# Altium schematic sheet RS232_485.SchDoc
size A4
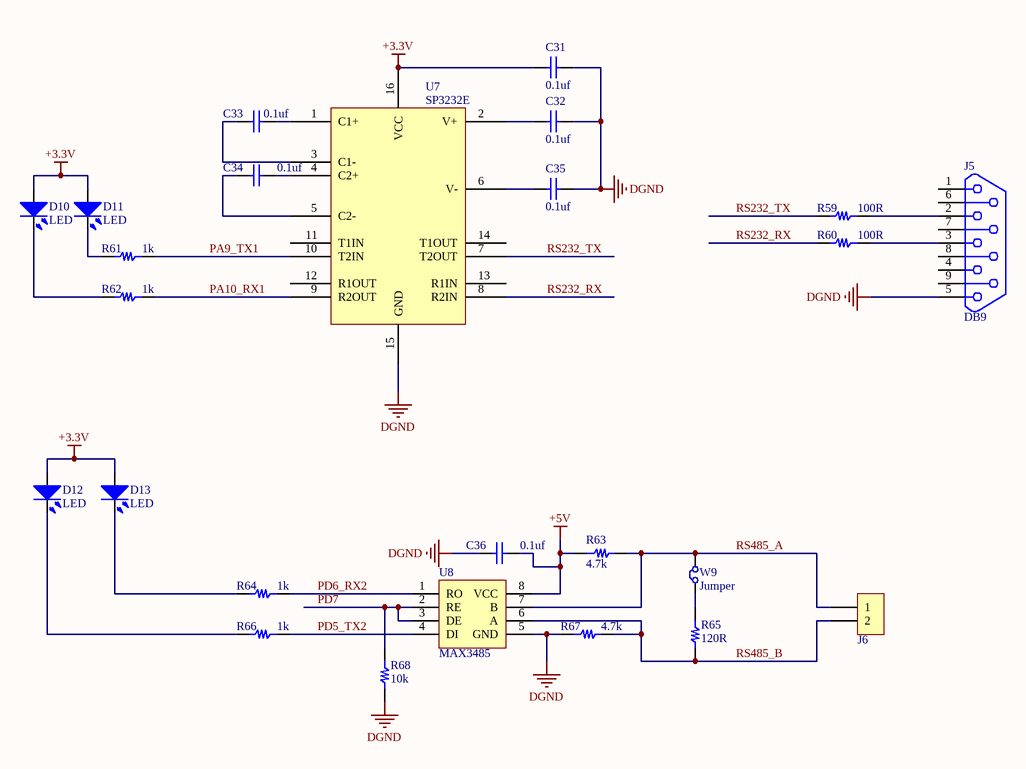
[diagram p0: RS232_485.SchDoc]

## Parts
C31  0.1uf  [0805C]
C32  0.1uf  [0805C]
C33  0.1uf  [0805C]
C34  0.1uf  [0805C]
C35  0.1uf  [0805C]
C36  0.1uf  [0805C]
D10  LED  [0805-LED-RED]
D11  LED  [0805-LED-RED]
D12  LED  [0805-LED-RED]
D13  LED  [0805-LED-RED]
J5  DB9  [DB9RA/M]
J6  CON2  [XH2.54-2P]  (value not drawn)
R59  100R  [0805_small]
R60  100R  [0805_small]
R61  1k  [0805_small]
R62  1k  [0805_small]
R63  4.7k  [0805_small]
R64  1k  [0805_small]
R65  120R  [0805_small]
R66  1k  [0805_small]
R67  4.7k  [0805_small]
R68  10k  [0805_small]
U7  SP3232E  [SO-16]
U8  MAX3485  [SO-8]
W9  Jumper  [0603_jump_Pad]

## Nets
+3.3V: C31.2 D10.1(A) D11.1(A) D12.1(A) D13.1(A) U7.16(VCC)
+5V: C36.1 R63.1 U8.8(VCC)
DGND: C31.1 C32.1 C35.1 C36.2 J5.5 R67.1 R68.2 U7.15(GND) U8.5(GND)
PA9_TX1: R61.1 U7.10(T2IN)
PA10_RX1: R62.1 U7.9(R2OUT)
PD5_TX2: R66.1 U8.4(DI)
PD6_RX2: R64.1 U8.1(RO)
PD7: R68.1 U8.2(RE) U8.3(DE)
RS232_RX: R60.2 U7.8(R2IN)
RS232_TX: R59.2 U7.7(T2OUT)
RS485_A: J6.1 R63.2 U8.7(B) W9.2(C2)
RS485_B: J6.2 R65.2 R67.2 U8.6(A)
NetC32_2: C32.2 U7.2(V+)
NetC33_1: C33.1 U7.1(C1+)
NetC33_2: C33.2 U7.3(C1-)
NetC34_1: C34.1 U7.4(C2+)
NetC34_2: C34.2 U7.5(C2-)
NetC35_2: C35.2 U7.6(V-)
NetD10_2: D10.2(K) R62.2
NetD11_2: D11.2(K) R61.2
NetD12_2: D12.2(K) R66.2
NetD13_2: D13.2(K) R64.2
NetJ5_2: J5.2 R59.1
NetJ5_3: J5.3 R60.1
NetR65_1: R65.1 W9.1(C1)

Not connected (* = marked no-connect by the designer): J5 1 4 6 7 8 9; U7 11(T1IN) 12(R1OUT) 13(R1IN) 14(T1OUT)

## Library data of the parts
C31-C36 = Cap: 贴片电容; Value: 100pF; Published: 8-Jun-2000; LatestRevisionDate: 17-Jul-2002; LatestRevisionNote: Re-released for DXP Platform.; PackageReference: RAD-0.3; Publisher: Altium Limited
D10-D13 = LED: Typical INFRARED GaAs LED; Published: 8-Jun-2000; LatestRevisionDate: 08-Jul-2005; LatestRevisionNote: Mech Layer 1 removed.; PackageReference: LED-0; Publisher: Altium Limited; PackageDescription: LED; 2 Leads
J6 = CON2: Connector
R59-R68 = Res: 电阻; Value: 230k; Published: 24-Mar-1999; LatestRevisionDate: 29-May-2009; LatestRevisionNote: IPC-7351 Footprint Added.; PackageVersion: Mar-2003; PackageReference: 6-0805; Publisher: Altium Limited; PackageDescription: Chip Resistor 0805 Case Size; Code_IPC: RESC2012
W9 = Jumper: Jumper Wire; Published: 24-Mar-1999; LatestRevisionDate: 17-Jul-2002; LatestRevisionNote: Re-released for DXP Platform.; PackageReference: RAD-0.2; Publisher: Altium Limited; PackageDescription: Radial Cap, Thru-Hole; 2 Leads; 0.2 in Pin Spacing